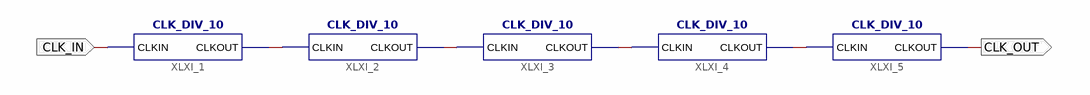
[diagram p0: schematic sheet 1]
// Xilinx ISE schematic CLK_DIV_100K.sch (spartan6) as structural Verilog: 5 symbols, 2 ports
module CLK_DIV_100K (
  input  CLK_IN,
  output CLK_OUT
);

  wire XLXN_1, XLXN_2, XLXN_3, XLXN_4;

  CLK_DIV_10 XLXI_1 (.CLKIN(CLK_IN), .CLKOUT(XLXN_1));
  CLK_DIV_10 XLXI_2 (.CLKIN(XLXN_1), .CLKOUT(XLXN_2));
  CLK_DIV_10 XLXI_3 (.CLKIN(XLXN_2), .CLKOUT(XLXN_3));
  CLK_DIV_10 XLXI_4 (.CLKIN(XLXN_3), .CLKOUT(XLXN_4));
  CLK_DIV_10 XLXI_5 (.CLKIN(XLXN_4), .CLKOUT(CLK_OUT));
endmodule
